# EAGLE design Power Entry (EAGLE 9.5.2)
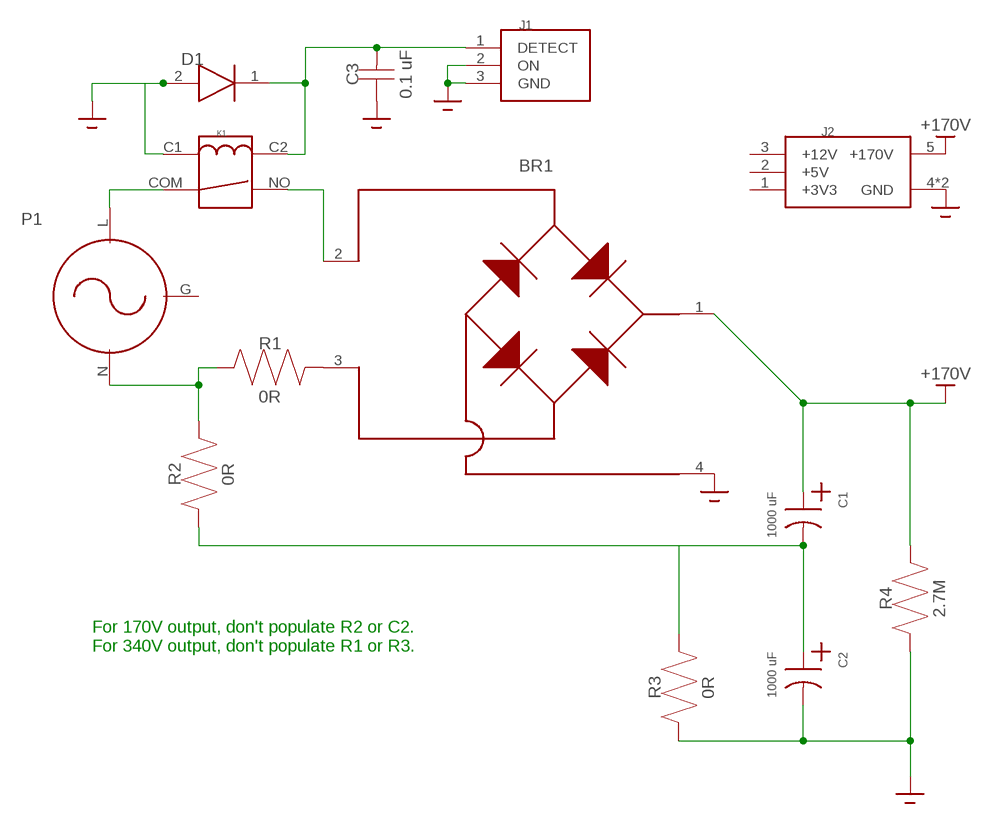
[diagram p0: schematic, sheet 1]

## Parts
BR1  GBJ1004-BP  [GBJ1004-BP]
C1  1000 uF  ESMQ351VSN102MA50S  [ESMQ351VSN102MA50S]
C2  1000 uF  ESMQ351VSN102MA50S  [ESMQ351VSN102MA50S]
C3  0.1 uF  CAPACITOR0805  [0805]
D1  BAT54HT1GBAT54HT1G  [SOD2512X110N]
J1  1-770967-0  [1-770967-0]
J2  1-770969-0  [1-770969-0]
K1  ALQ3F12  [ALQ3F12]
P1  703W-00/04  [703W-00/04]
R1  0R  RESISTOR0805  [0805]
R2  0R  RESISTOR0805  [0805]
R3  0R  RESISTOR0805  [0805]
R4  2.7M  RESISTOR0805  [0805]

## Nets
+170V: BR1.1(POSITIVE_DC) C1.+ J2.5(+170V) R4.P$2
GND: BR1.4(NEGATIVE_DC) C2.- C3.P$1 D1.2(ANODE(2)) J1.2(ON) J1.3(GND) J2.4(GND) J2.6(GND) K1.C1 R3.P$1 R4.P$1
N$1: BR1.3(AC_IN2) R1.P$2
N$2: P1.N(NEUTRAL) R1.P$1 R2.P$2
N$3: C1.- C2.+ R2.P$1 R3.P$2
N$4: K1.COM(S1) P1.L(LIVE)
N$6: BR1.2(AC_IN1) K1.NO(S2)
N$8: C3.P$2 D1.1(CATHODE(1)) J1.1(DETECT) K1.C2
Unconnected: P1.G(EARTH)

## Notes on the sheet
- For 170V output, don't populate R2 or C2.
  For 340V output, don't populate R1 or R3.

## Power pins joined to a net without a drawn wire
+3V3: J2.1(+3V3)
+5V: J2.2(+5V)
+12V: J2.3(+12V)

## Library data of the parts
BR1 = Dane:GBJ1004-BP
C1 C2 = Zach:ESMQ351VSN102MA50S
C3 = Zach:CAPACITOR
D1 = Dane:BAT54HT1G
J1 = Zach:1-770967-0
J2 = Zach:1-770969-0
K1 = Zach:ALQ3F12
P1 = Jim:703W-00/04
R1-R4 = Zach:RESISTOR

## Board
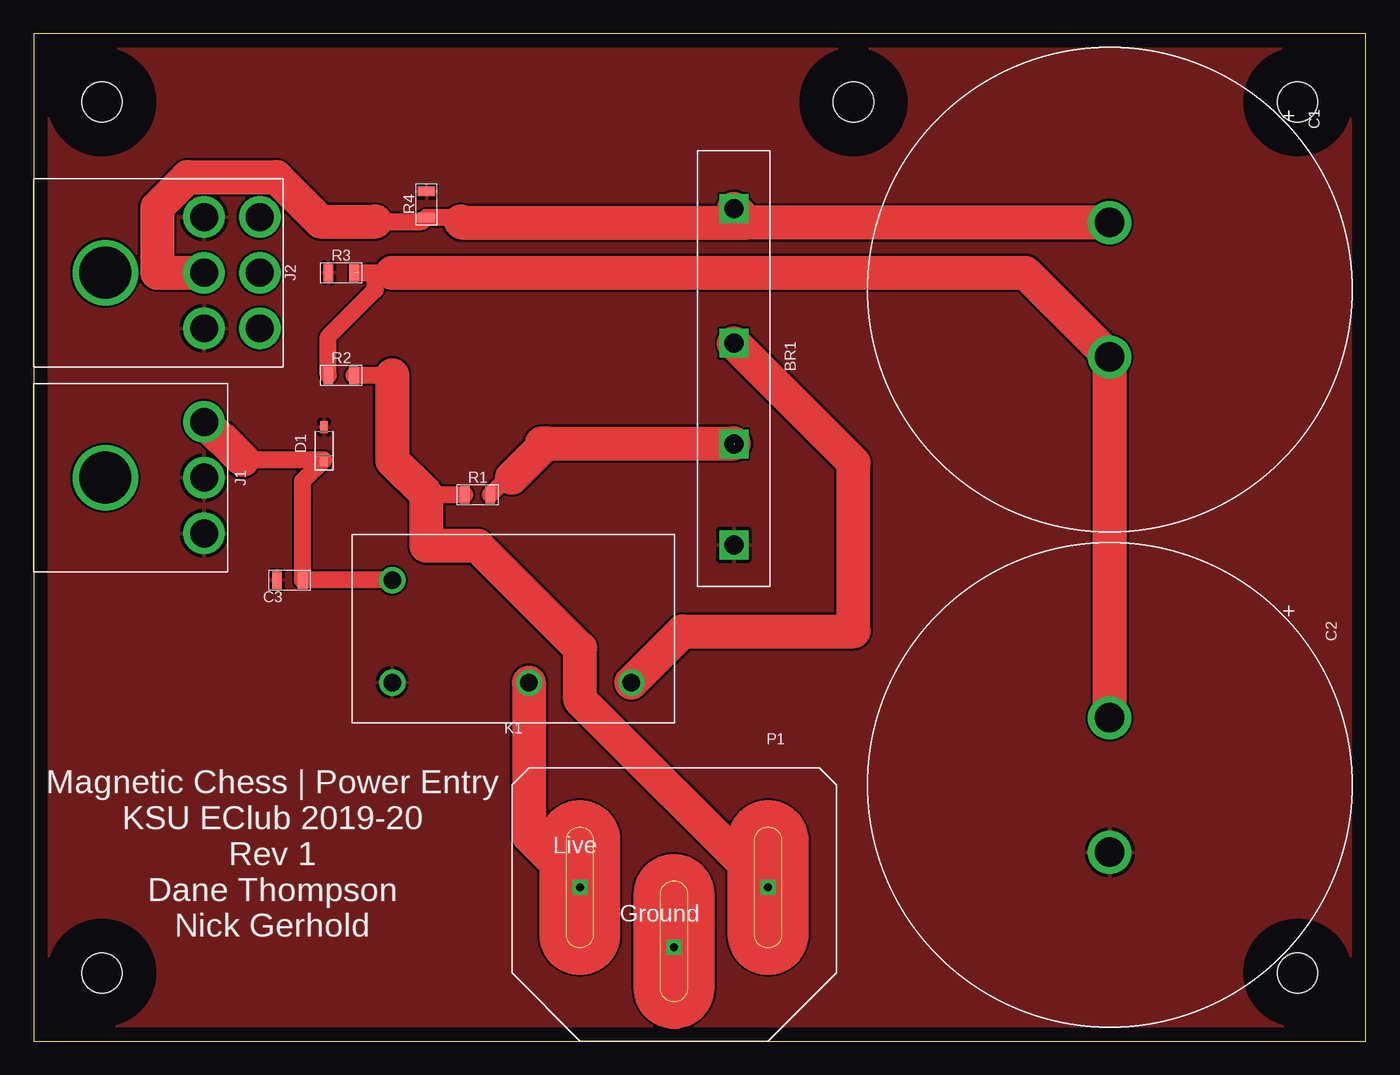
[diagram p1: board, top side]
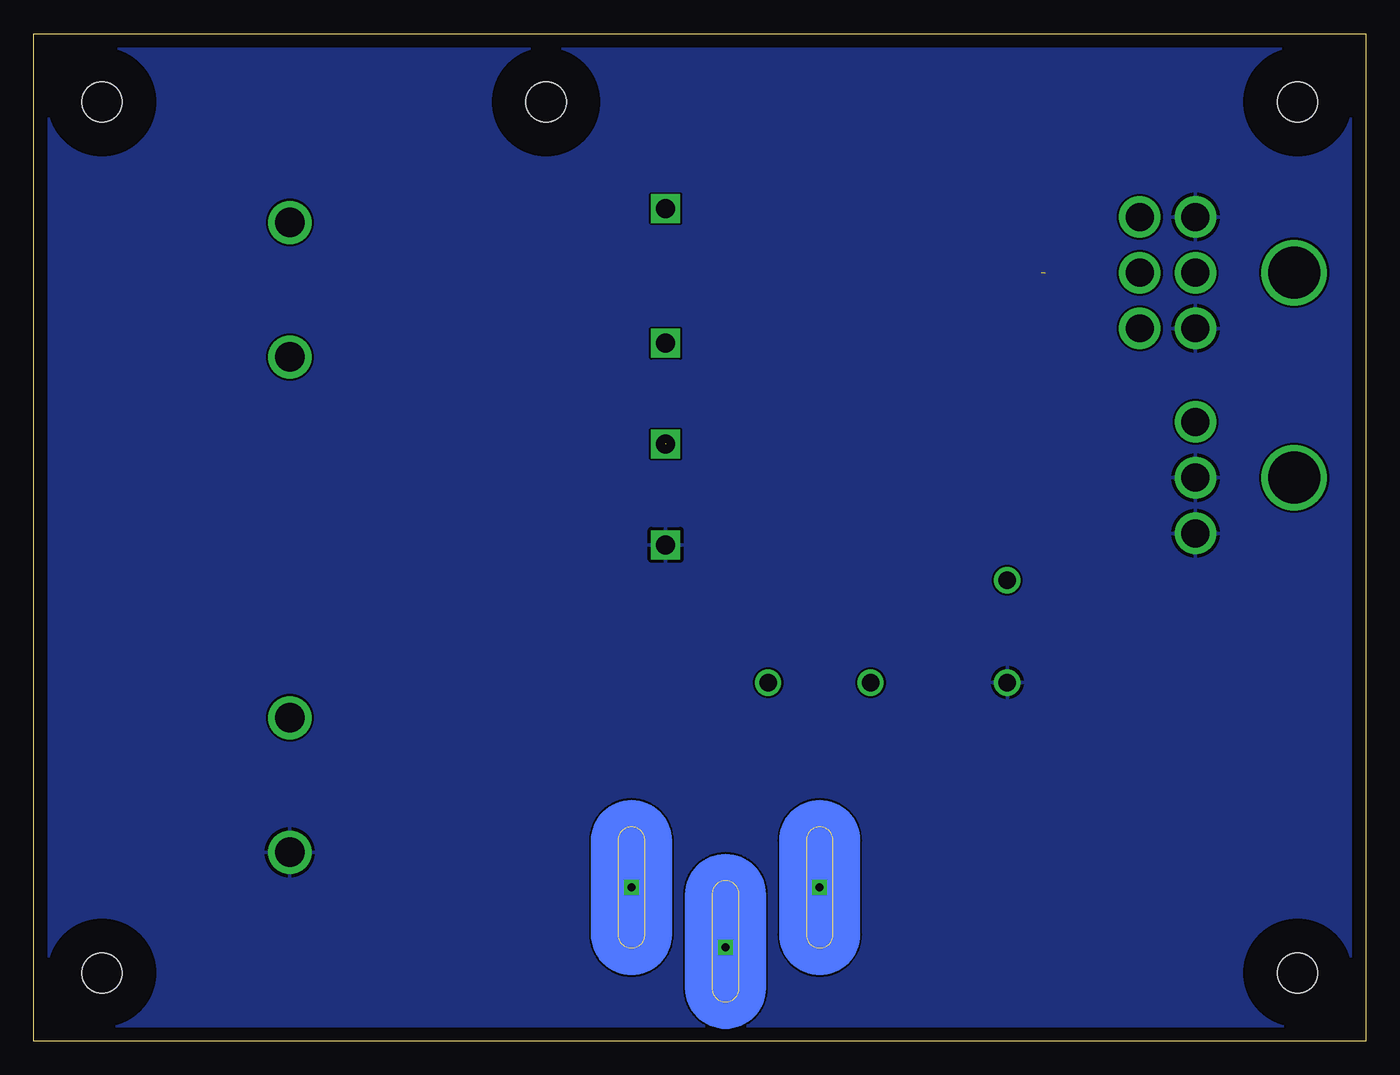
[diagram p2: board, bottom side, seen from below]

Size 99.06 x 74.93 mm. Coordinates in mm from the lower left corner, seen from the top.
Outline: 0,0 99.06,0 99.06,74.93 0,74.93 0,0
Copper layers (1*16): Top 0.035mm / dielectric 1.5mm / Bottom 0.035mm
Design rules "default": minimum track width 6mil, minimum drill 0.35mm, track to track 6mil, track to pad 6mil, pad to pad 6mil, via to via 6mil, smd to smd 6mil, copper to edge 40mil, drill to drill 6mil, minimum pad ring 10mil, minimum via ring 8mil, stop-mask expansion 4mil, vias tented up to drill 0mil, thermal gap 10mil
Holes 3 mm at 5.08,5.08 93.98,5.08 93.98,69.85 5.08,69.85 60.96,69.85
tRestrict: area 1.1,1.1 to 9.1,9.1; area 90,1.1 to 98,9.1; area 90,65.8 to 98,73.9; area 1.1,65.8 to 9.1,73.9; area 56.9,65.8 to 65,73.9
bRestrict: area 1.1,1.1 to 9.1,9.1; area 90,1.1 to 98,9.1; area 90,65.8 to 98,73.9; area 1.1,65.8 to 9.1,73.9; area 56.9,65.8 to 65,73.9

### Footprints (pad centres in the part's own frame; a part is rotated, then mirrored left to right if it is on the bottom)
GBJ1004-BP = drill 1.43 square: 1 -20,0; 2 -10,0; 3 -2.5,0; 4 5,0
ESMQ351VSN102MA50S = drill 2.2 pad 2.8: + -5,0; - 5,0
0805 = smd 0.711 x 1.295: P$1 -0.953,0; P$2 0.953,0
SOD2512X110N = smd 0.888 x 0.572: 1 -1.221,0; 2 1.221,0
1-770967-0 = drill 2.07: 1 -4.14,12.67; 2 0,12.67; 3 4.14,12.67 | drill 3.86: 4 0,5.33
1-770969-0 = drill 2.07: 1 4.14,16.81; 2 0,16.81; 3 -4.14,16.81; 4 4.14,12.67; 5 0,12.67; 6 -4.14,12.67 | drill 3.86: 7 0,5.33
ALQ3F12 = drill 1.3: C1 0,0; C2 0,-7.62; COM -10.16,0; NO -17.78,0
703W-00/04 = drill 0.6 square: G 6.985,4.445; L 13.97,0; N 0,0

### Placement (x,y rotation side)
BR1  52.07,41.91 270 top
C1  80.01,55.88 270 top
C2  80.01,19.05 270 top
C3  19.05,34.29 0 top
D1  21.59,44.45 90 top
J1  0,41.91 270 top
J2  0,57.15 270 top
K1  26.67,26.67 180 top
P1  54.61,11.43 180 top
R1  33.02,40.64 0 top
R2  22.86,49.53 0 top
R3  22.86,57.15 0 top
R4  29.21,62.23 270 top

### Tracks (layer width: path | path; a pad name or v marks a point on that pad's centre or on a via)
+170V
  Top 1.27: 31.75,60.96 31.43,61.28 R4.P$2 28.89,60.96 25.4,60.96
  Top 2.54: C1.+ 53.1,60.88 | 53.1,60.88 BR1.1 | J2.5 9.19,57.15 9.19,62 11.44,64.25 18.04,64.25 21.33,60.96 25.4,60.96 | 31.75,60.96 31.83,60.88 53.1,60.88
GND
  pour Top: 0,0 0,74.93 99.06,74.93 99.06,0
  pour Bottom: 0,0 0,74.93 99.06,74.93 99.06,0
N$1  (1 unrouted)
  Top 1.27: R1.P$2 35.24,41.91 35.56,41.91
  Top 2.54: 37.78,44.45 38.1,44.45 | 38.1,44.45 52.07,44.45 | 35.56,41.91 38.1,44.45
N$2
  Top 1.27: R2.P$2 26.67,49.53 | 29.21,40.64 R1.P$1
  Top 2.54: 26.67,49.53 26.67,43.18 29.21,40.64 29.21,36.83 33.02,36.83 40.64,29.21 40.64,25.4 P1.N
N$3  (1 unrouted)
  Top 1.27: 24.13,57.15 25.4,57.15 | 25.4,57.15 26.67,57.15 | R2.P$1 21.91,52.39 25.4,55.88 25.4,57.15
  Top 2.54: C2.+ C1.- 73.74,57.15 26.67,57.15
N$4
  Top 2.54: P1.L 36.83,15.24 K1.COM
N$6
  Top 2.54: K1.NO 48.26,30.48 60.96,30.48 60.96,43.02 BR1.2
N$8
  Top 1.27: K1.C2 C3.P$2 20,41.64 D1.1 15.54,43.23
  Top 2.54: 15.54,43.23 13.9,44.88 13.85,44.88 J1.1

### Text on the board
tPlace: Magnetic Chess | Power Entry / KSU EClub 2019-20 / Rev 1 / Dane Thompson / Nick Gerhold